# Altium schematic sheet STM32G473CET6_PINOUT.SchDoc
size C; SheetNumber: 6; SheetTotal: 11
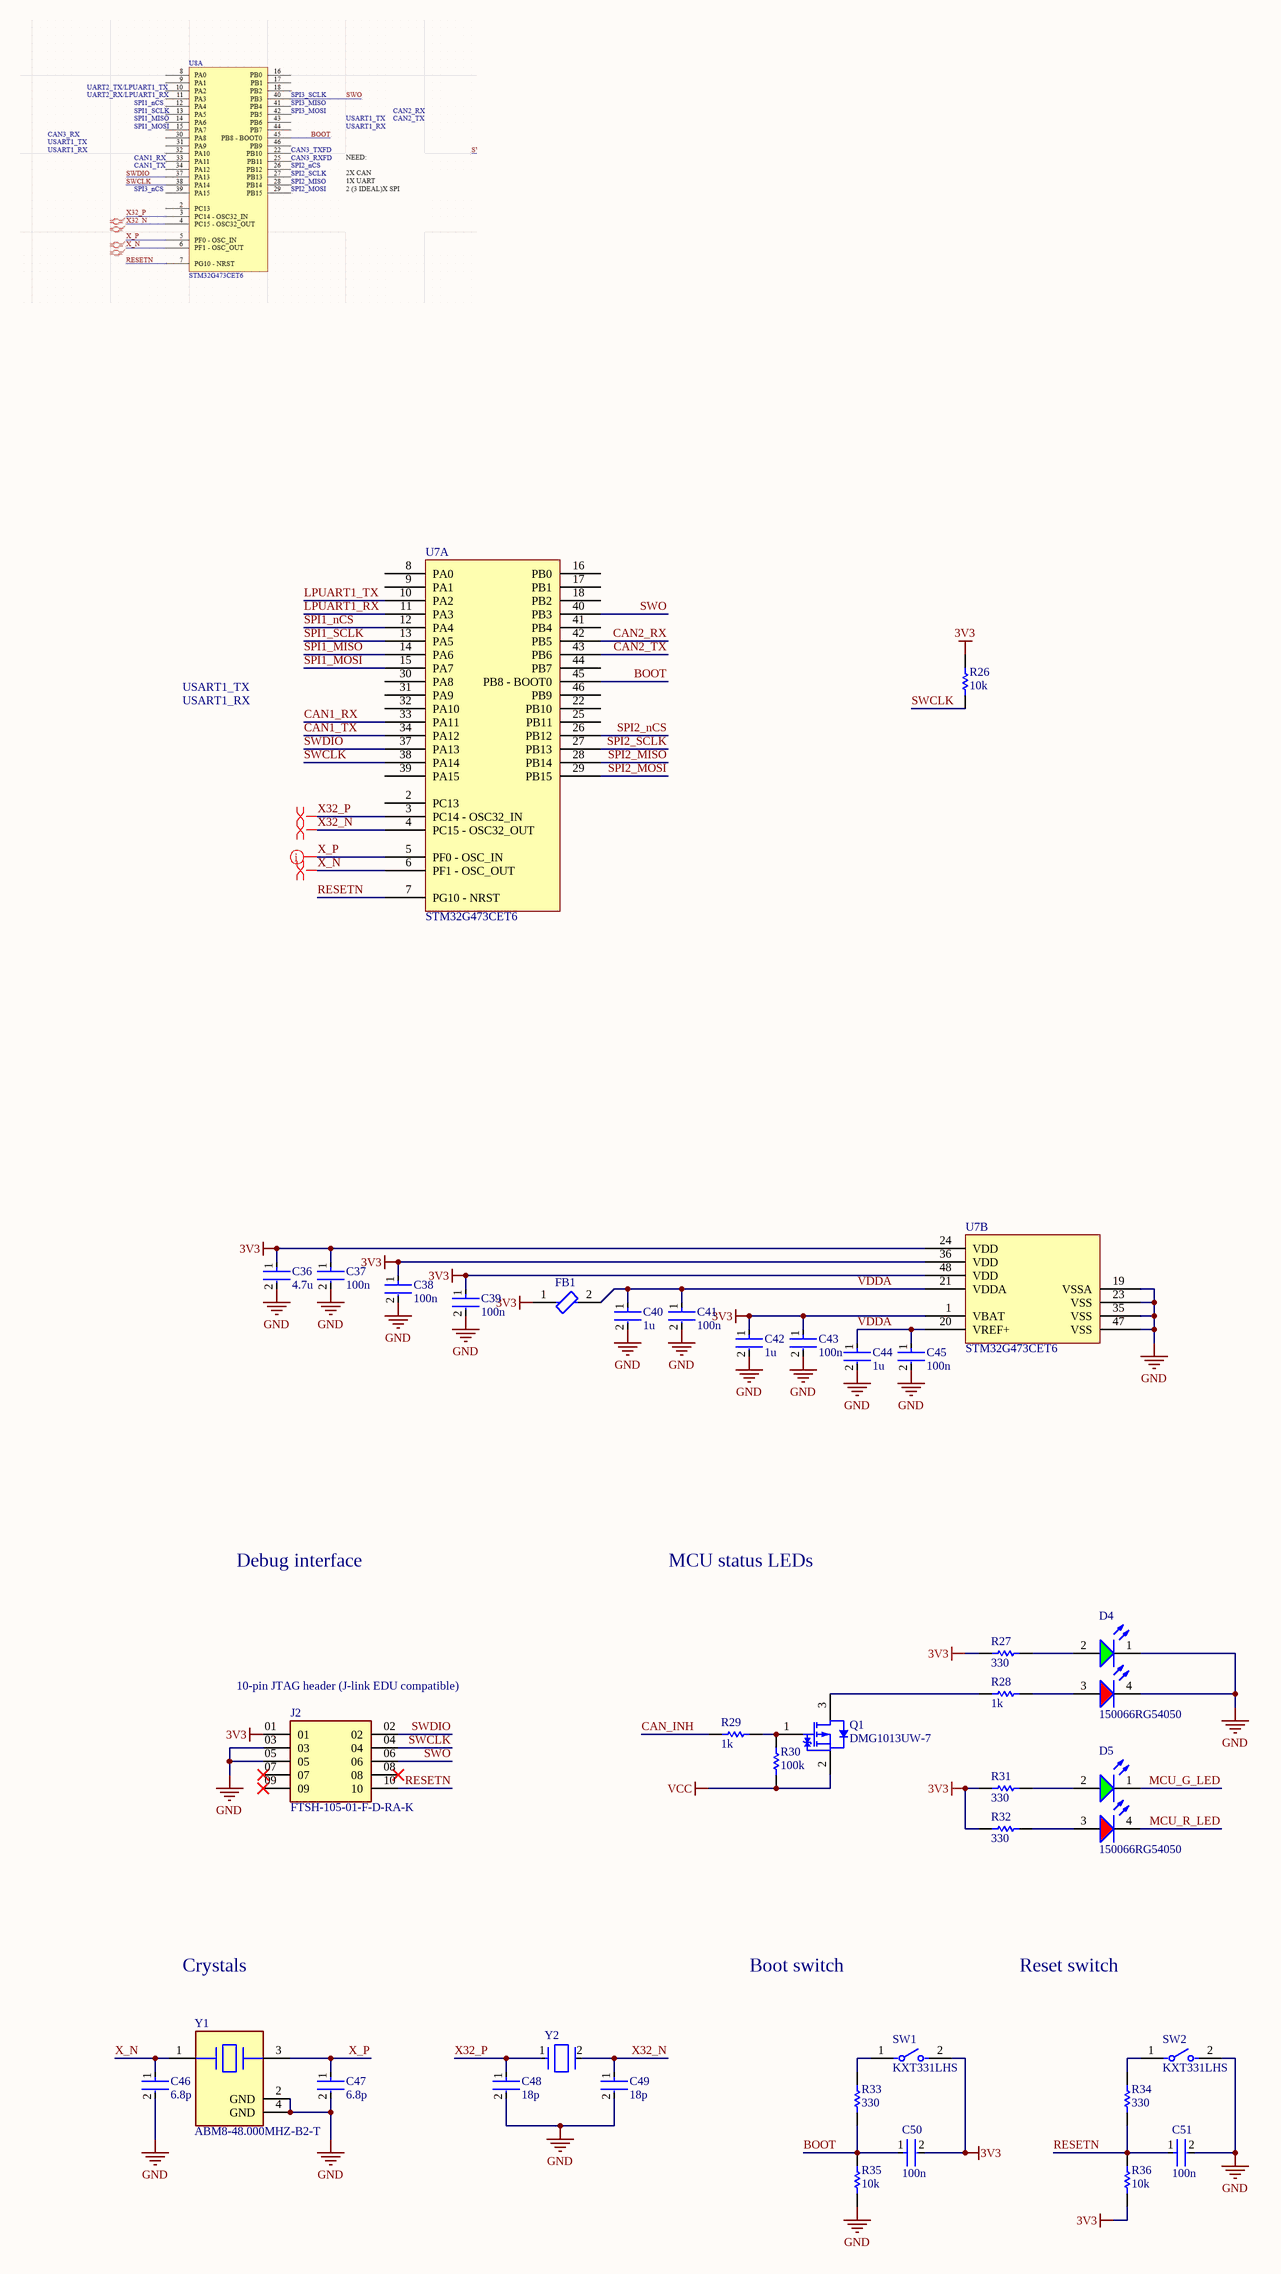
[diagram p0: STM32G473CET6_PINOUT.SchDoc]

## Parts
C36  4.7u  [FP-0402-L_1_0_0_05-W_0_5-IPC_A]
C37  100n  [FP-0402-L_1_0_0_05-W_0_5-IPC_A]
C38  100n  [FP-0402-L_1_0_0_05-W_0_5-IPC_A]
C39  100n  [FP-0402-L_1_0_0_05-W_0_5-IPC_A]
C40  1u  [FP-0402-L_1_0_0_05-W_0_5-IPC_A]
C41  100n  [FP-0402-L_1_0_0_05-W_0_5-IPC_A]
C42  1u  [FP-0402-L_1_0_0_05-W_0_5-IPC_A]
C43  100n  [FP-0402-L_1_0_0_05-W_0_5-IPC_A]
C44  1u  [FP-0402-L_1_0_0_05-W_0_5-IPC_A]
C45  100n  [FP-0402-L_1_0_0_05-W_0_5-IPC_A]
C46  6.8p  [FP-0402-L_1_0_0_05-W_0_5-IPC_A]
C47  6.8p  [FP-0402-L_1_0_0_05-W_0_5-IPC_A]
C48  18p  [FP-0402-L_1_0_0_05-W_0_5-IPC_A]
C49  18p  [FP-0402-L_1_0_0_05-W_0_5-IPC_A]
C50  100n  [FP-0402-L_1_0_0_05-W_0_5-IPC_A]
C51  100n  [FP-0402-L_1_0_0_05-W_0_5-IPC_A]
D4  150066RG54050  [WL-SBCD_0606]
D5  150066RG54050  [WL-SBCD_0606]
FB1  BLM15PX601SN1D  [FP-BLM15-0_05-MFG]  (value not drawn)
J2  FTSH-105-01-F-D-RA-K  [FTSH-105-01-F-D-RA-K-Footprint-1]
Q1  DMG1013UW-7  [DIOD-SOT323-3_V]
R26  10k  [R0603B]
R27  330  [R0603B]
R28  1k  [R0603B]
R29  1k  [R0603B]
R30  100k  [R0603B]
R31  330  [R0603B]
R32  330  [R0603B]
R33  330  [R0603B]
R34  330  [R0603B]
R35  10k  [R0603B]
R36  10k  [R0603B]
SW1  KXT331LHS  [FP-KXT331LHS-MFG]
SW2  KXT331LHS  [FP-KXT331LHS-MFG]
U7  STM32G473CET6  [TSQFP50P900X900X160-48N]  (parts A,B of 2)
Y1  ABM8-48.000MHZ-B2-T  [FP-ABM8-MFG]
Y2  ECS-.327-12.5-1210-TR  [FP-ECX-1210-MFG]  (value not drawn)

## Nets
3V3: C36.1 C37.1 C38.1 C39.1 C42.1 C43.1 C50.2 FB1.1 J2.01 R26.2 R27.2 R31.2 R32.2 R36.1 SW1.2 U7.1(VBAT) U7.24(VDD) U7.36(VDD) U7.48(VDD)
GND: C36.2 C37.2 C38.2 C39.2 C40.2 C41.2 C42.2 C43.2 C44.2 C45.2 C46.2 C47.2 C48.2 C49.2 C51.2 D4.1(K) D4.4(K) J2.03 J2.05 R35.1 SW2.2 U7.19(VSSA) U7.23(VSS) U7.35(VSS) U7.47(VSS) Y1.2(GND) Y1.4(GND)
VCC: Q1.2(S) R30.2
BOOT: C50.1 R33.1 R35.2 U7.45(PB8_-_BOOT0)
CAN1_RX: U7.33(PA11)
CAN1_TX: U7.34(PA12)
CAN2_RX: U7.42(PB5)
CAN2_TX: U7.43(PB6)
CAN_INH: R29.2
LPUART1_RX: U7.11(PA3)
LPUART1_TX: U7.10(PA2)
MCU_G_LED: D5.1(K)
MCU_R_LED: D5.4(K)
RESETN: C51.1 J2.10 R34.1 R36.2 U7.7(PG10_-_NRST)
SPI1_MISO: U7.14(PA6)
SPI1_MOSI: U7.15(PA7)
SPI1_nCS: U7.12(PA4)
SPI1_SCLK: U7.13(PA5)
SPI2_MISO: U7.28(PB14)
SPI2_MOSI: U7.29(PB15)
SPI2_nCS: U7.26(PB12)
SPI2_SCLK: U7.27(PB13)
SWCLK: J2.04 R26.1 U7.38(PA14)
SWDIO: J2.02 U7.37(PA13)
SWO: J2.06 U7.40(PB3)
VDDA: C40.1 C41.1 C44.1 C45.1 FB1.2 U7.20(VREF+) U7.21(VDDA)
X32_N: C49.1 U7.4(PC15_-_OSC32_OUT) Y2.2(Out/In)
X32_P: C48.1 U7.3(PC14_-_OSC32_IN) Y2.1(In/Out)
X_N: C46.1 U7.6(PF1_-_OSC_OUT) Y1.1
X_P: C47.1 U7.5(PF0_-_OSC_IN) Y1.3
NetD4_2: D4.2(A) R27.1
NetD4_3: D4.3(A) R28.1
NetD5_2: D5.2(A) R31.1
NetD5_3: D5.3(A) R32.1
NetQ1_1: Q1.1(G) R29.1 R30.1
NetQ1_3: Q1.3(D) R28.2
NetR33_2: R33.2 SW1.1
NetR34_2: R34.2 SW2.1

Not connected (* = marked no-connect by the designer): J2 07* 08* 09*; U7 2(PC13) 8(PA0) 9(PA1) 16(PB0) 17(PB1) 18(PB2) 22(PB10) 25(PB11) 30(PA8) 31(PA9) 32(PA10) 39(PA15) 41(PB4) 44(PB7) 46(PB9)

## Layout directives
differential pair: X32_N, X32_P, X_N, X_P

## Notes on the sheet
- USART1_TX
- USART1_RX
- Debug interface
- MCU status LEDs
- (near J2) 10-pin JTAG header (J-link EDU compatible)
- Crystals
- Boot switch
- Reset switch

## Library data of the parts
C36-C51 = CMP-001-00058-1: LARGE PADS, 0402 CAP, CHANGE COMMENT TO MATCH REAL P/N; Capacitor Type: Ceramic; Min Operating Temperature: -55°C; Mounting Technology: Surface Mount; Pins: 2; Case/Package: 0402; RoHS Compliant: Yes; Max Operating Temperature: 85°C
D4 D5 = CMP-004-00040-2: Led, Red/Grn, 180Mcd/230Mcd, 624Nm/525Nm Rohs Compliant: Yes; Source: rgled.SchLib; Component Type: Standard; Design Item ID: CMP-004-00034-2; Pins: 4
FB1 = CMP-0686-00252-4: Chip Ferrite Bead, 0402, 600Ω @ 100MHz, 0.23Ω, 25%, 900mA; Number of Circuits: 1; Impedance: 600R; DC Resistance (DCR): 230mR; Material: Steel; Length: 1mm; Package Quantity: 10000; Height: 0.5mm; Width: 0.5mm; Max DC Current: 900mA; Number of Lines: 1; Termination: SMD/SMT; Packaging: Tape and Reel; Lead Free: Lead Free; Min Operating Temperature: -55°C; Max Operating Temperature: 125°C; Max Current Rating: 900mA; Case Code (Imperial): 0402; Number of Pins: 2; Current Rating: 900mA; Test Frequency: 100MHz; Case/Package: 0402; Tolerance: 25%; Case Code (Metric): 1005
J2 = CMP-002-00041-5: Board Connector, 10 Contact(s), 2 Row(s), Male, Right Angle, 0.05 inch Pitch, Surface Mount Terminal, Locking, Black Insulator; Connector Type: BOARD CONNECTOR; Mounting Technology: Board; RoHS Compliant: Yes
Q1 = CMP-2000-06170-1: P-Channel Enhancement Mode MOSFET, 310 mW, 20 V, -55 to 150 degC, 3-Pin SOT-323, RoHS, Tape and Reel; Manufacturer: Diodes Inc; Qg Gate Charge: 0.622nC; Drain-Source On Resistance-Max: 750mO; Rated Power Dissipation: 310mW; Drain-to-Source Voltage [Vdss]: 20V; Package Reference: SOT323; Datasheet Version: Rev. 3-2, 09/2013; Package Description: 3-Pin Small Outline Transistor, Body 2 x 1.25 mm, Pitch 0.65 mm; Mounting Technology: SurfaceMount; Manufacturer URL: http://www.diodes.com/; Datasheet URL: http://www.diodes.com/_files/datasheets/ds31861.pdf; Channel Type: P-Channel
R26-R36 = CMP-009-00002-14: Resistor
SW1 SW2 = CMP-10040-000029-1: SWITCH TACTILE SPST-NO 0.02A 15V; Operating Force: 240gf; Switch Travel: 0.13mm; Illumination Type: Non-Illuminated; Throw Configuration: SPST; Number of Ports: 1; Current Rating: 5A; Mechanical Life: 500000Cycles; Switch Function: Off-Mom; Connector Type: USB; Actuator Type: Standard; Gender: Receptacle; Number of Contacts: 24; Contact Plating: Gold; Insulation Color: Black; Min Operating Temperature: -40°C; Packaging: Tape and Reel; Flammability Rating: UL94 V-0; Max Operating Temperature: 85°C; Termination: Solder; Mount: Surface Mount
U7 = CMP-020-00018-2: RISC Microcontroller, 32-Bit, 170MHz; RoHS Compliant: Yes
Y1 = CMP-27762-011708-1: Crystal 48MHz ±20ppm 18pF SMD-4 3.2mm x 2.5mm; Series Resistance: 35R; Frequency Stability: 50ppm; Package Quantity: 1000; Packaging: Tape and Reel; Mount: Surface Mount; Length: 3.2mm; Load Capacitance: 18pF; Max Operating Temperature: 70°C; Operating Frequency: 48 MHz; RoHS Compliant: Yes; Series: ABM8; Frequency Tolerance: 20ppm; Lead Free: Lead Free; Min Operating Temperature: -20°C; Case/Package: CSMD; Number of Pins: 4; Height: 0.031inch; ESR (Equivalent Series Resistance): 35R; Frequency: 48MHz; Radiation Hardening: No; Width: 0.098inch; Tolerance: 20ppm; Termination: SMD/SMT; Depth: 2.5mm; Resistor Type: Ceramic; REACH SVHC: No SVHC
Y2 = CMP-40224-000006-1: CRYSTAL 32.7680KHZ 12.5PF SMD; Manufacturer: ECS International; Frequency: 32.768kHz; Esr: 90kΩ; Tolerance: 20ppm; Device Class L1: Passive Components; Load Capacitance: 12.5pF; Temperature: -40°C to +85°C; ComponentLink2URL: https://ecsxtal.com/store/pdf/ECX-1210.pdf; Series: ECX-1210; Octopart: https://octopart.com/ecs-.327-12.5-1210-tr-ecs+international-81221340; ComponentLink2Description: Datasheet; Temperature Range Low: -40°C; Digikey Description: CRYSTAL 32.7680KHZ 12.5PF SMD; Lead Free: Yes; RoHS: TRUE; Device Class L3: Crystals; Automotive: No; Category: Crys; Height: 0.5mm; Manufacturer Part Number: ECS-.327-12.5-1210-TR; Temperature Range High: +85°C; Device Class L2: Crystals / Oscillators; Package: ECX-1210